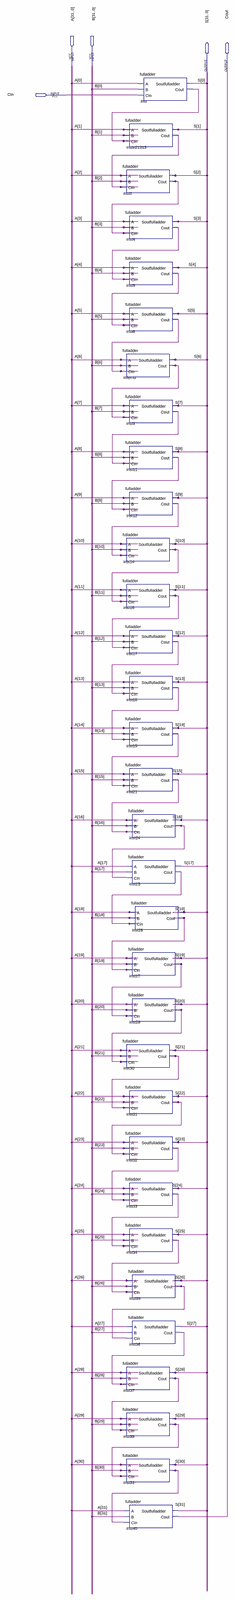
[diagram p0: schematic sheet, whole]
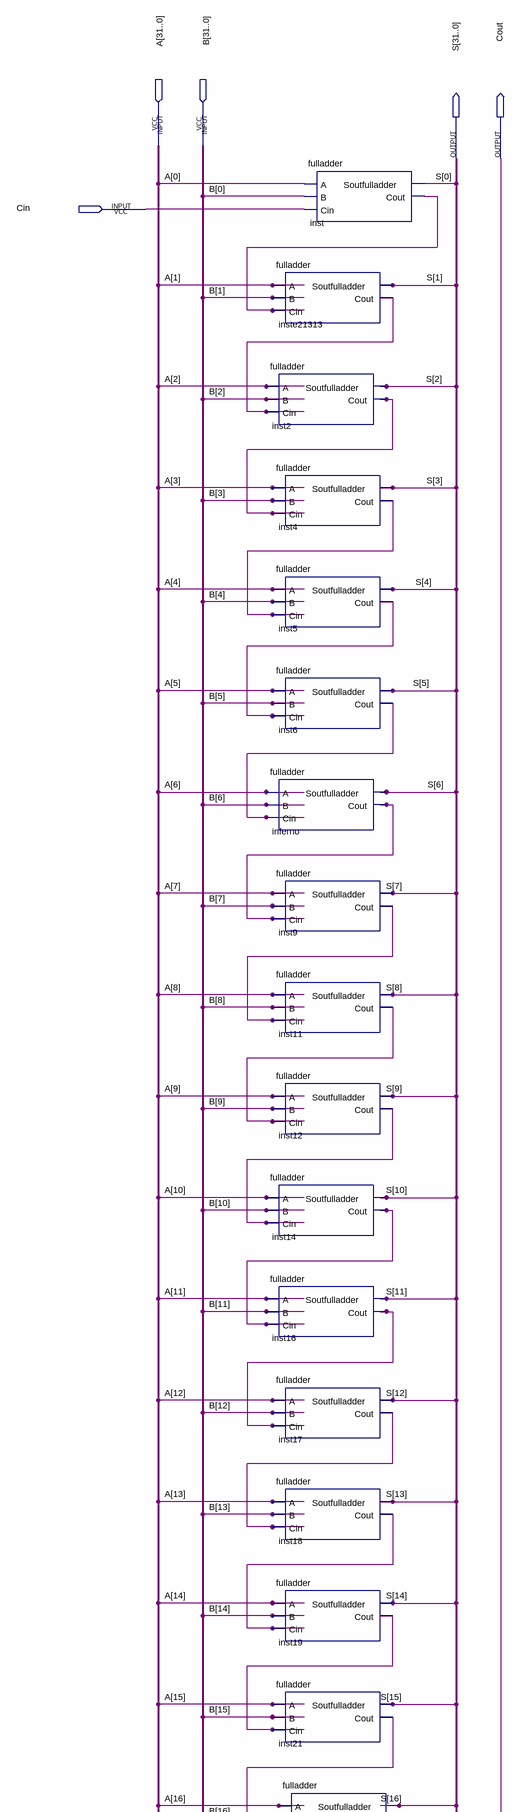
[diagram p1: schematic sheet, upper part]
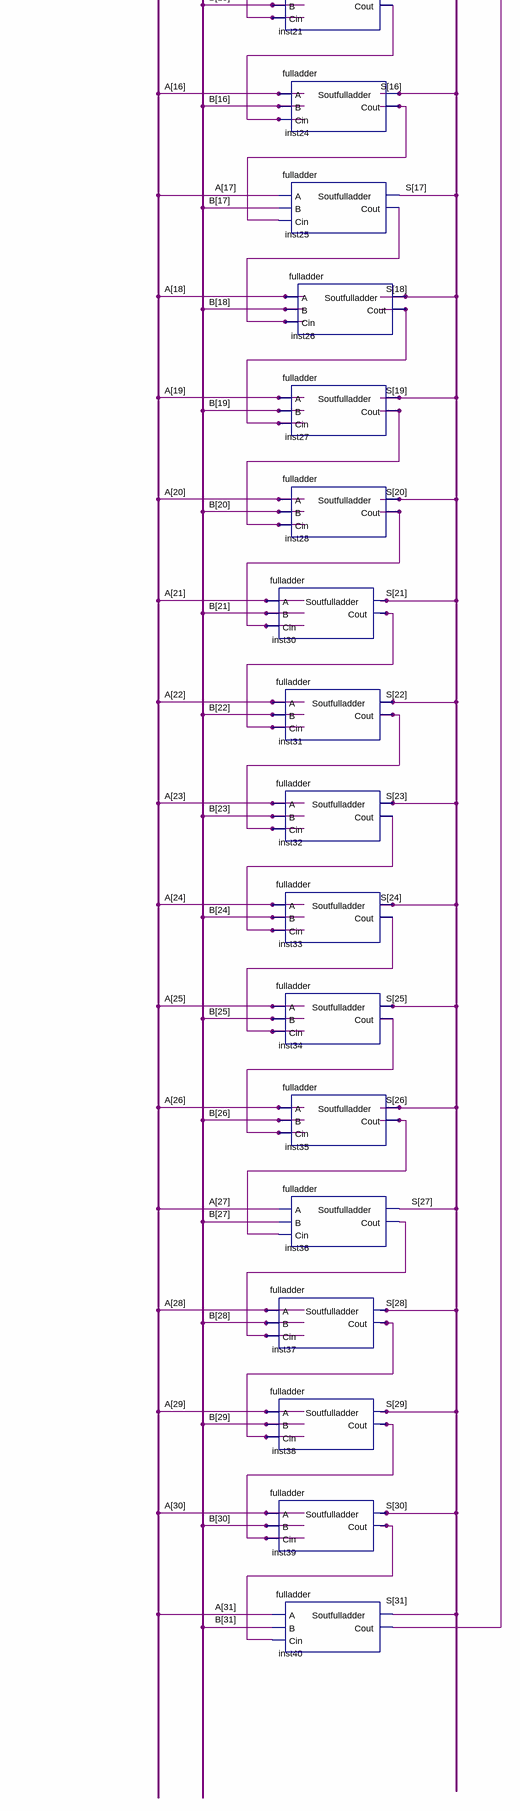
[diagram p2: schematic sheet, lower part]
// Quartus schematic Adder32Bits.bdf as structural Verilog: 32 symbols, 5 pins
module Adder32Bits (
  input  [31:0] A,
  input  [31:0] B,
  input  Cin,
  output [31:0] S,
  output Cout
);

  wire inferno_cout, inst2_cout, inst4_cout, inst5_cout, inst6_cout, inst9_cout, inst11_cout, inst12_cout,
       inst14_cout, inst16_cout, inst17_cout, inst18_cout, inst19_cout, inst21_cout, inst24_cout,
       inst25_cout, inst26_cout, inst27_cout, inst28_cout, inst30_cout, inst31_cout, inst32_cout,
       inst33_cout, inst34_cout, inst35_cout, inst36_cout, inst37_cout, inst38_cout, inst39_cout, inst_cout,
       inste21313_cout;

  fulladder inste21313 (.A(A[1]), .B(B[1]), .Cin(inst_cout), .Soutfulladder(S[1]), .Cout(inste21313_cout));
  fulladder inst2 (.A(A[2]), .B(B[2]), .Cin(inste21313_cout), .Soutfulladder(S[2]), .Cout(inst2_cout));
  fulladder inst4 (.A(A[3]), .B(B[3]), .Cin(inst2_cout), .Soutfulladder(S[3]), .Cout(inst4_cout));
  fulladder inst5 (.A(A[4]), .B(B[4]), .Cin(inst4_cout), .Soutfulladder(S[4]), .Cout(inst5_cout));
  fulladder inst6 (.A(A[5]), .B(B[5]), .Cin(inst5_cout), .Soutfulladder(S[5]), .Cout(inst6_cout));
  fulladder inferno (.A(A[6]), .B(B[6]), .Cin(inst6_cout), .Soutfulladder(S[6]), .Cout(inferno_cout));
  fulladder inst9 (.A(A[7]), .B(B[7]), .Cin(inferno_cout), .Soutfulladder(S[7]), .Cout(inst9_cout));
  fulladder inst11 (.A(A[8]), .B(B[8]), .Cin(inst9_cout), .Soutfulladder(S[8]), .Cout(inst11_cout));
  fulladder inst12 (.A(A[9]), .B(B[9]), .Cin(inst11_cout), .Soutfulladder(S[9]), .Cout(inst12_cout));
  fulladder inst14 (.A(A[10]), .B(B[10]), .Cin(inst12_cout), .Soutfulladder(S[10]), .Cout(inst14_cout));
  fulladder inst16 (.A(A[11]), .B(B[11]), .Cin(inst14_cout), .Soutfulladder(S[11]), .Cout(inst16_cout));
  fulladder inst17 (.A(A[12]), .B(B[12]), .Cin(inst16_cout), .Soutfulladder(S[12]), .Cout(inst17_cout));
  fulladder inst18 (.A(A[13]), .B(B[13]), .Cin(inst17_cout), .Soutfulladder(S[13]), .Cout(inst18_cout));
  fulladder inst19 (.A(A[14]), .B(B[14]), .Cin(inst18_cout), .Soutfulladder(S[14]), .Cout(inst19_cout));
  fulladder inst21 (.A(A[15]), .B(B[15]), .Cin(inst19_cout), .Soutfulladder(S[15]), .Cout(inst21_cout));
  fulladder inst30 (.A(A[21]), .B(B[21]), .Cin(inst28_cout), .Soutfulladder(S[21]), .Cout(inst30_cout));
  fulladder inst31 (.A(A[22]), .B(B[22]), .Cin(inst30_cout), .Soutfulladder(S[22]), .Cout(inst31_cout));
  fulladder inst32 (.A(A[23]), .B(B[23]), .Cin(inst31_cout), .Soutfulladder(S[23]), .Cout(inst32_cout));
  fulladder inst33 (.A(A[24]), .B(B[24]), .Cin(inst32_cout), .Soutfulladder(S[24]), .Cout(inst33_cout));
  fulladder inst34 (.A(A[25]), .B(B[25]), .Cin(inst33_cout), .Soutfulladder(S[25]), .Cout(inst34_cout));
  fulladder inst37 (.A(A[28]), .B(B[28]), .Cin(inst36_cout), .Soutfulladder(S[28]), .Cout(inst37_cout));
  fulladder inst38 (.A(A[29]), .B(B[29]), .Cin(inst37_cout), .Soutfulladder(S[29]), .Cout(inst38_cout));
  fulladder inst39 (.A(A[30]), .B(B[30]), .Cin(inst38_cout), .Soutfulladder(S[30]), .Cout(inst39_cout));
  fulladder inst40 (.A(A[31]), .B(B[31]), .Cin(inst39_cout), .Soutfulladder(S[31]), .Cout(Cout));
  fulladder inst (.A(A[0]), .B(B[0]), .Cin(Cin), .Soutfulladder(S[0]), .Cout(inst_cout));
  fulladder inst24 (.A(A[16]), .B(B[16]), .Cin(inst21_cout), .Soutfulladder(S[16]), .Cout(inst24_cout));
  fulladder inst25 (.A(A[17]), .B(B[17]), .Cin(inst24_cout), .Soutfulladder(S[17]), .Cout(inst25_cout));
  fulladder inst26 (.A(A[18]), .B(B[18]), .Cin(inst25_cout), .Soutfulladder(S[18]), .Cout(inst26_cout));
  fulladder inst27 (.A(A[19]), .B(B[19]), .Cin(inst26_cout), .Soutfulladder(S[19]), .Cout(inst27_cout));
  fulladder inst28 (.A(A[20]), .B(B[20]), .Cin(inst27_cout), .Soutfulladder(S[20]), .Cout(inst28_cout));
  fulladder inst35 (.A(A[26]), .B(B[26]), .Cin(inst34_cout), .Soutfulladder(S[26]), .Cout(inst35_cout));
  fulladder inst36 (.A(A[27]), .B(B[27]), .Cin(inst35_cout), .Soutfulladder(S[27]), .Cout(inst36_cout));
endmodule
